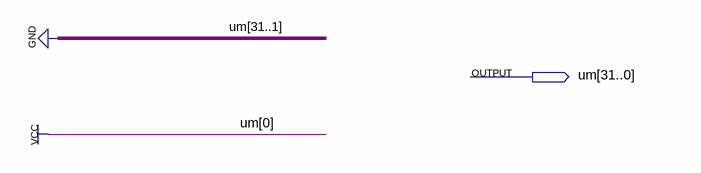
[diagram p0: schematic sheet]
// Quartus schematic um.bdf as structural Verilog: 0 symbols, 1 pins
module um (
  output [31:0] um
);


  assign um = 32'b00000000000000000000000000000001;
endmodule
